# EAGLE design chlorophyll_analizer_extra (EAGLE 9.4.2)
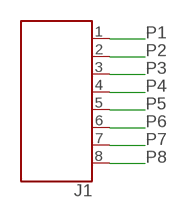
[diagram p0: schematic, sheet 1]

## Parts
J1  687108183722  [687108183722]

## Nets
P1: J1.1
P2: J1.2
P3: J1.3
P4: J1.4
P5: J1.5
P6: J1.6
P7: J1.7
P8: J1.8

## Library data of the parts
J1 = Eagle_FPC_CONNECTOR_AND_FFC_CAB (rev18c):687108183722: 687108183722 WR-FPC 0.50mm SMT Horizontal Bottom Contact - Low Profile <http://katalog.we-online.de/media/images/v2/Family_WR-FPC_6871xx183722.jpg> Details see: http://katalog.we-online.de/en/em/FPC_0_5_SMT_ZIF_HORIZONTAL_BOTTOM_CONTACT_LOW_PROFILE_6871xx183722 Created by Yingchun,shan 2016 (C) Wurth Elektronik

## Board
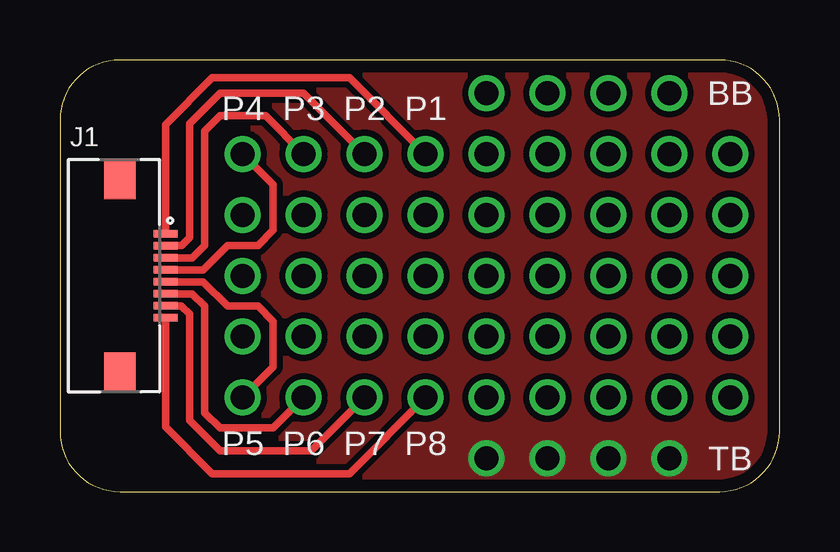
[diagram p1: board, top side]
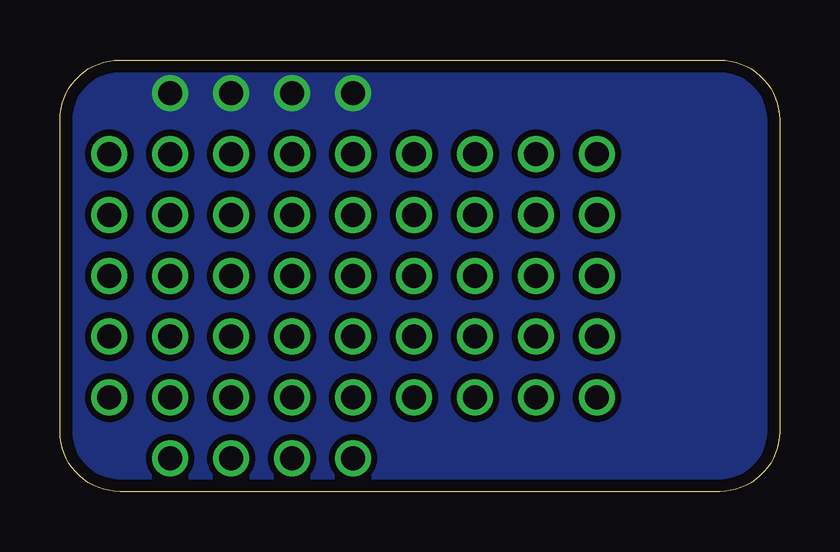
[diagram p2: board, bottom side, seen from below]

Size 30 x 18 mm. Coordinates in mm from the lower left corner, seen from the top.
Outline: 27.5,18 2.5,18 arc90 0,15.5 0,2.5 arc90 2.5,0 27.5,0 arc90 30,2.5 30,15.5 arc90 27.5,18
Copper layers (1*16): Top 0.035mm / dielectric 1.6mm / Bottom 0.035mm
Design rules "Elecrow_2-layer_PCB_eagle_rule": minimum track width 6mil, minimum drill 12mil, track to track 6mil, track to pad 6mil, pad to pad 6mil, via to via 8mil, smd to smd 0mil, copper to edge 20mil, drill to drill 10mil, minimum pad ring 6mil, minimum via ring 6mil, stop-mask expansion 0mil, vias tented up to drill 100mil, thermal gap 10mil

### Footprints (pad centres in the part's own frame; a part is rotated, then mirrored left to right if it is on the bottom)
687108183722 = smd 0.3 x 1: 1 -1.75,1.9; 2 -1.25,1.9; 3 -0.75,1.9; 4 -0.25,1.9; 5 0.25,1.9; 6 0.75,1.9; 7 1.25,1.9; 8 1.75,1.9 | smd 1.65 x 1.3: Z1 -4.025,0; Z2 4.025,0

### Placement (x,y rotation side)
J1  2.5,9 270 top

### Tracks (layer width: path | path; a pad name or v marks a point on that pad's centre or on a via)
GND  (via drill 1)
  other vias: 17.78,1.38 20.32,1.38 22.86,1.38 25.4,1.38
  pour Top (isolate 0.254, no thermals): -1,19 32,19 32,-1 -1,-1
N$1  (via drill 1)
  other vias: 25.4,3.92
N$2  (via drill 1)
  other vias: 25.4,6.46
N$3  (via drill 1)
  other vias: 7.62,11.54
N$4  (via drill 1)
  other vias: 7.62,9
N$5  (via drill 1)
  other vias: 7.62,6.46
N$6  (via drill 1)
  other vias: 27.94,3.92
N$7  (via drill 1)
  other vias: 25.4,14.08
N$8  (via drill 1)
  other vias: 10.16,6.46
N$9  (via drill 1)
  other vias: 10.16,9
N$10  (via drill 1)
  other vias: 10.16,11.54
N$11  (via drill 1)
  other vias: 27.94,14.08
N$12  (via drill 1)
  other vias: 25.4,11.54
N$13  (via drill 1)
  other vias: 12.7,11.54
N$14  (via drill 1)
  other vias: 12.7,9
N$15  (via drill 1)
  other vias: 12.7,6.46
N$16  (via drill 1)
  other vias: 27.94,11.54
N$17  (via drill 1)
  other vias: 27.94,9
N$18  (via drill 1)
  other vias: 15.24,6.46
N$19  (via drill 1)
  other vias: 15.24,9
N$20  (via drill 1)
  other vias: 15.24,11.54
N$21  (via drill 1)
  other vias: 25.4,9
N$22  (via drill 1)
  other vias: 17.78,14.08
N$23  (via drill 1)
  other vias: 17.78,11.54
N$24  (via drill 1)
  other vias: 17.78,9
N$25  (via drill 1)
  other vias: 17.78,6.46
N$26  (via drill 1)
  other vias: 17.78,3.92
N$27  (via drill 1)
  other vias: 20.32,3.92
N$28  (via drill 1)
  other vias: 20.32,6.46
N$29  (via drill 1)
  other vias: 20.32,9
N$30  (via drill 1)
  other vias: 20.32,11.54
N$31  (via drill 1)
  other vias: 20.32,14.08
N$32  (via drill 1)
  other vias: 22.86,14.08
N$33  (via drill 1)
  other vias: 22.86,11.54
N$34  (via drill 1)
  other vias: 22.86,9
N$35  (via drill 1)
  other vias: 22.86,6.46
N$36  (via drill 1)
  other vias: 22.86,3.92
N$37  (via drill 1)
  other vias: 27.94,6.46
P1  (via drill 1)
  Top 0.305: v15.24,14.08 12.06,17.26 6.35,17.26 4.4,15.3 J1.1
P2  (via drill 1)
  Top 0.305: J1.2 4.42,10.27 5.08,10.27 5.4,10.59 5.4,15.35 6.67,16.62 10.16,16.62 v12.7,14.08
P3  (via drill 1)
  Top 0.305: J1.3 5.51,9.75 6.03,10.27 6.03,15.03 6.67,15.67 8.57,15.67 v10.16,14.08
P4  (via drill 1)
  Top 0.305: J1.4 5.96,9.25 6.99,10.27 8.26,10.27 8.89,10.9 8.89,12.81 v7.62,14.08
P5  (via drill 1)
  Top 0.305: J1.5 5.96,8.75 6.99,7.73 8.26,7.73 8.89,7.09 8.89,5.19 v7.62,3.92
P6  (via drill 1)
  Top 0.305: J1.6 5.51,8.25 6.03,7.73 6.03,3.29 6.67,2.65 8.89,2.65 v10.16,3.92
P7  (via drill 1)
  Top 0.305: J1.7 5.06,7.75 5.4,7.41 5.4,2.97 6.67,1.7 10.48,1.7 v12.7,3.92
P8  (via drill 1)
  Top 0.305: J1.8 4.4,2.7 6.35,0.74 12.06,0.74 v15.24,3.92
VCC  (via drill 1)
  other vias: 17.78,16.62 20.32,16.62 22.86,16.62 25.4,16.62
  pour Bottom (isolate 0.254): 0,18 30,18 30,0 0,0

### Text on the board
tPlace: BB | P4 | P3 | P2 | P1 | P5 | P6 | P7 | P8 | TB